# Altium schematic sheet Backplane.SchDoc
size A4; SheetNumber: 1; SheetTotal: 2
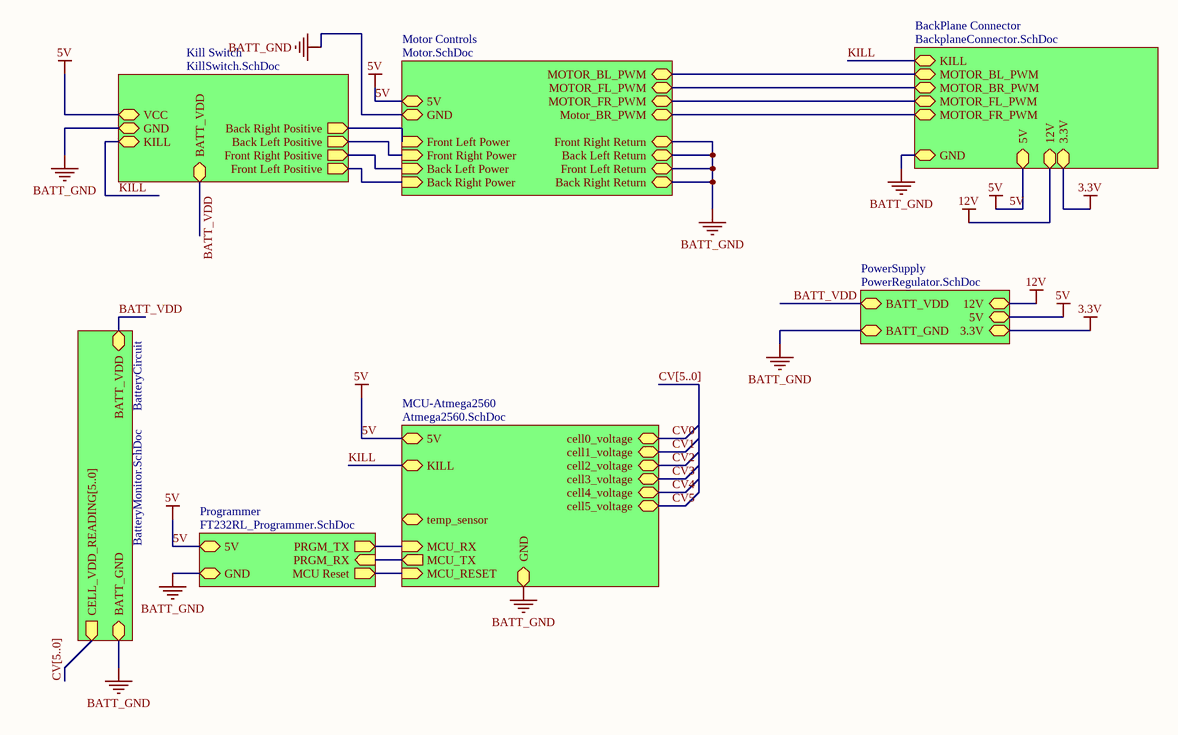
[diagram p0: Backplane.SchDoc]

## Sub-sheets
BackPlane Connector = BackplaneConnector.SchDoc: MOTOR_BL_PWM, MOTOR_BR_PWM, MOTOR_FL_PWM, MOTOR_FR_PWM, GND, 5V, KILL, 12V, 3.3V
BatteryCircuit = BatteryMonitor.SchDoc: BATT_VDD, BATT_GND, CELL_VDD_READING[5..0] (out)
Kill Switch = KillSwitch.SchDoc: Front Left Positive (out), Front Right Positive (out), Back Left Positive (out), Back Right Positive (out), VCC, GND, KILL (bidir), BATT_VDD
MCU-Atmega2560 = Atmega2560.SchDoc: 5V, GND, cell0_voltage (bidir), cell1_voltage (bidir), cell2_voltage (bidir), cell3_voltage (bidir), cell4_voltage (bidir), cell5_voltage (bidir), temp_sensor (bidir), MCU_TX (out), MCU_RX (in), MCU_RESET (in), KILL (bidir)
Motor Controls = Motor.SchDoc: Back Right Power (in), Back Left Power (in), Front Right Power (in), Front Left Power (in), Front Right Return, Back Left Return, Front Left Return, Back Right Return, 5V, MOTOR_BL_PWM, MOTOR_FL_PWM, MOTOR_FR_PWM, Motor_BR_PWM, GND
PowerSupply = PowerRegulator.SchDoc: BATT_VDD, 12V, 5V, 3.3V, BATT_GND
Programmer = FT232RL_Programmer.SchDoc: GND, PRGM_TX (out), PRGM_RX (in), MCU Reset (out), 5V

## Nets
3.3V: sheet BackPlane Connector/3.3V, sheet PowerSupply/3.3V
5V: sheet Kill Switch/VCC, sheet Motor Controls/5V, sheet Programmer/5V, sheet BackPlane Connector/5V, sheet MCU-Atmega2560/5V, sheet PowerSupply/5V
12V: sheet BackPlane Connector/12V, sheet PowerSupply/12V
BATT_GND: sheet Kill Switch/GND, sheet Motor Controls/Front Right Return, sheet Motor Controls/Back Left Return, sheet Motor Controls/Front Left Return, sheet Motor Controls/Back Right Return, sheet Motor Controls/GND, sheet Programmer/GND, sheet BatteryCircuit/BATT_GND, sheet BackPlane Connector/GND, sheet MCU-Atmega2560/GND, sheet PowerSupply/BATT_GND
BATT_VDD: sheet Kill Switch/BATT_VDD, sheet BatteryCircuit/BATT_VDD, sheet PowerSupply/BATT_VDD
CV0: sheet MCU-Atmega2560/cell0_voltage
CV1: sheet MCU-Atmega2560/cell1_voltage
CV2: sheet MCU-Atmega2560/cell2_voltage
CV3: sheet MCU-Atmega2560/cell3_voltage
CV4: sheet MCU-Atmega2560/cell4_voltage
CV5: sheet MCU-Atmega2560/cell5_voltage
KILL: sheet Kill Switch/KILL, sheet BackPlane Connector/KILL, sheet MCU-Atmega2560/KILL
(unnamed): sheet Kill Switch/Front Left Positive, sheet Motor Controls/Back Right Power
(unnamed): sheet Kill Switch/Front Right Positive, sheet Motor Controls/Back Left Power
(unnamed): sheet Kill Switch/Back Left Positive, sheet Motor Controls/Front Right Power
(unnamed): sheet Kill Switch/Back Right Positive, sheet Motor Controls/Front Left Power
(unnamed): sheet Motor Controls/MOTOR_BL_PWM, sheet BackPlane Connector/MOTOR_BL_PWM
(unnamed): sheet Motor Controls/MOTOR_FL_PWM, sheet BackPlane Connector/MOTOR_BR_PWM
(unnamed): sheet Motor Controls/MOTOR_FR_PWM, sheet BackPlane Connector/MOTOR_FL_PWM
(unnamed): sheet Motor Controls/Motor_BR_PWM, sheet BackPlane Connector/MOTOR_FR_PWM
(unnamed): sheet Programmer/PRGM_TX, sheet MCU-Atmega2560/MCU_RX
(unnamed): sheet Programmer/PRGM_RX, sheet MCU-Atmega2560/MCU_TX
(unnamed): sheet Programmer/MCU Reset, sheet MCU-Atmega2560/MCU_RESET

## Buses and harness runs
bus CV[5..0]
bus CV[5..0] = sheet BatteryCircuit/CELL_VDD_READING[5..0]

## Notes on the sheet
- Title
- Size:
- Date:
- A4
- Number:
- Time:
- Revision:
- Sheet
- of
- File: